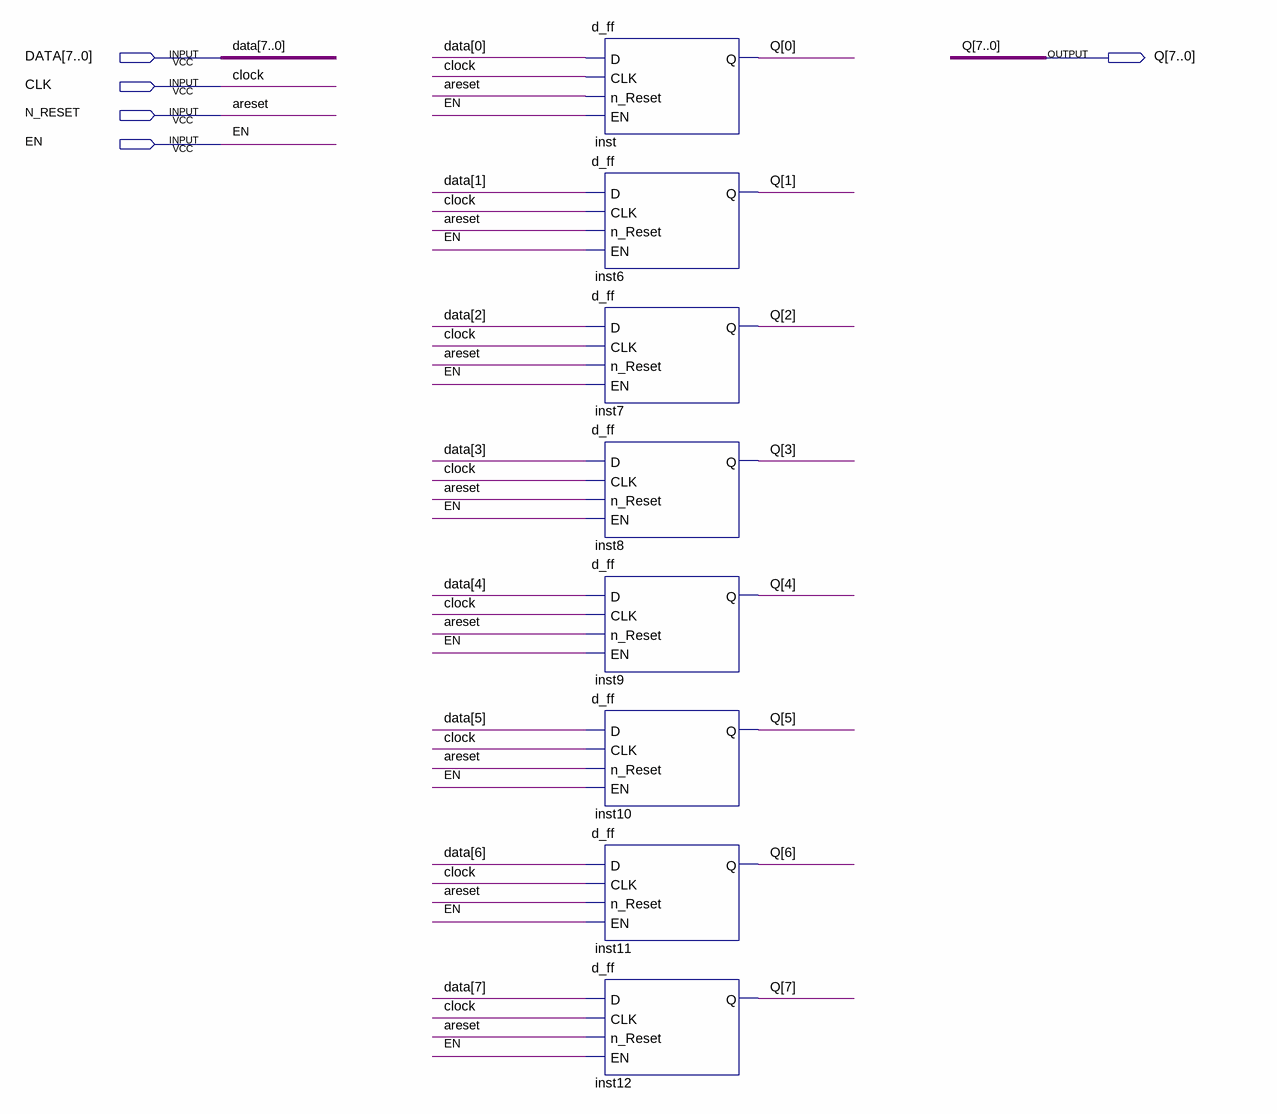
[diagram p0: schematic sheet]
// Quartus schematic pipo.bdf as structural Verilog: 8 symbols, 5 pins
module pipo (
  input  [7:0] DATA,
  input  CLK,
  input  N_RESET,
  input  EN,
  output [7:0] Q
);

  d_ff inst (.D(DATA[0]), .CLK(CLK), .n_Reset(N_RESET), .EN(EN), .Q(Q[0]));
  d_ff inst6 (.D(DATA[1]), .CLK(CLK), .n_Reset(N_RESET), .EN(EN), .Q(Q[1]));
  d_ff inst7 (.D(DATA[2]), .CLK(CLK), .n_Reset(N_RESET), .EN(EN), .Q(Q[2]));
  d_ff inst8 (.D(DATA[3]), .CLK(CLK), .n_Reset(N_RESET), .EN(EN), .Q(Q[3]));
  d_ff inst9 (.D(DATA[4]), .CLK(CLK), .n_Reset(N_RESET), .EN(EN), .Q(Q[4]));
  d_ff inst10 (.D(DATA[5]), .CLK(CLK), .n_Reset(N_RESET), .EN(EN), .Q(Q[5]));
  d_ff inst11 (.D(DATA[6]), .CLK(CLK), .n_Reset(N_RESET), .EN(EN), .Q(Q[6]));
  d_ff inst12 (.D(DATA[7]), .CLK(CLK), .n_Reset(N_RESET), .EN(EN), .Q(Q[7]));

  // Other names for the same wires on the sheet: areset = N_RESET; clock = CLK
endmodule
